# Altium schematic sheet Sheet4.SchDoc
size A3; Organization: Altium Limited; Address1: L3, 12a Rodborough Rd; Address2: Frenchs Forest; Address3: NSW; Address4: Australia 2086
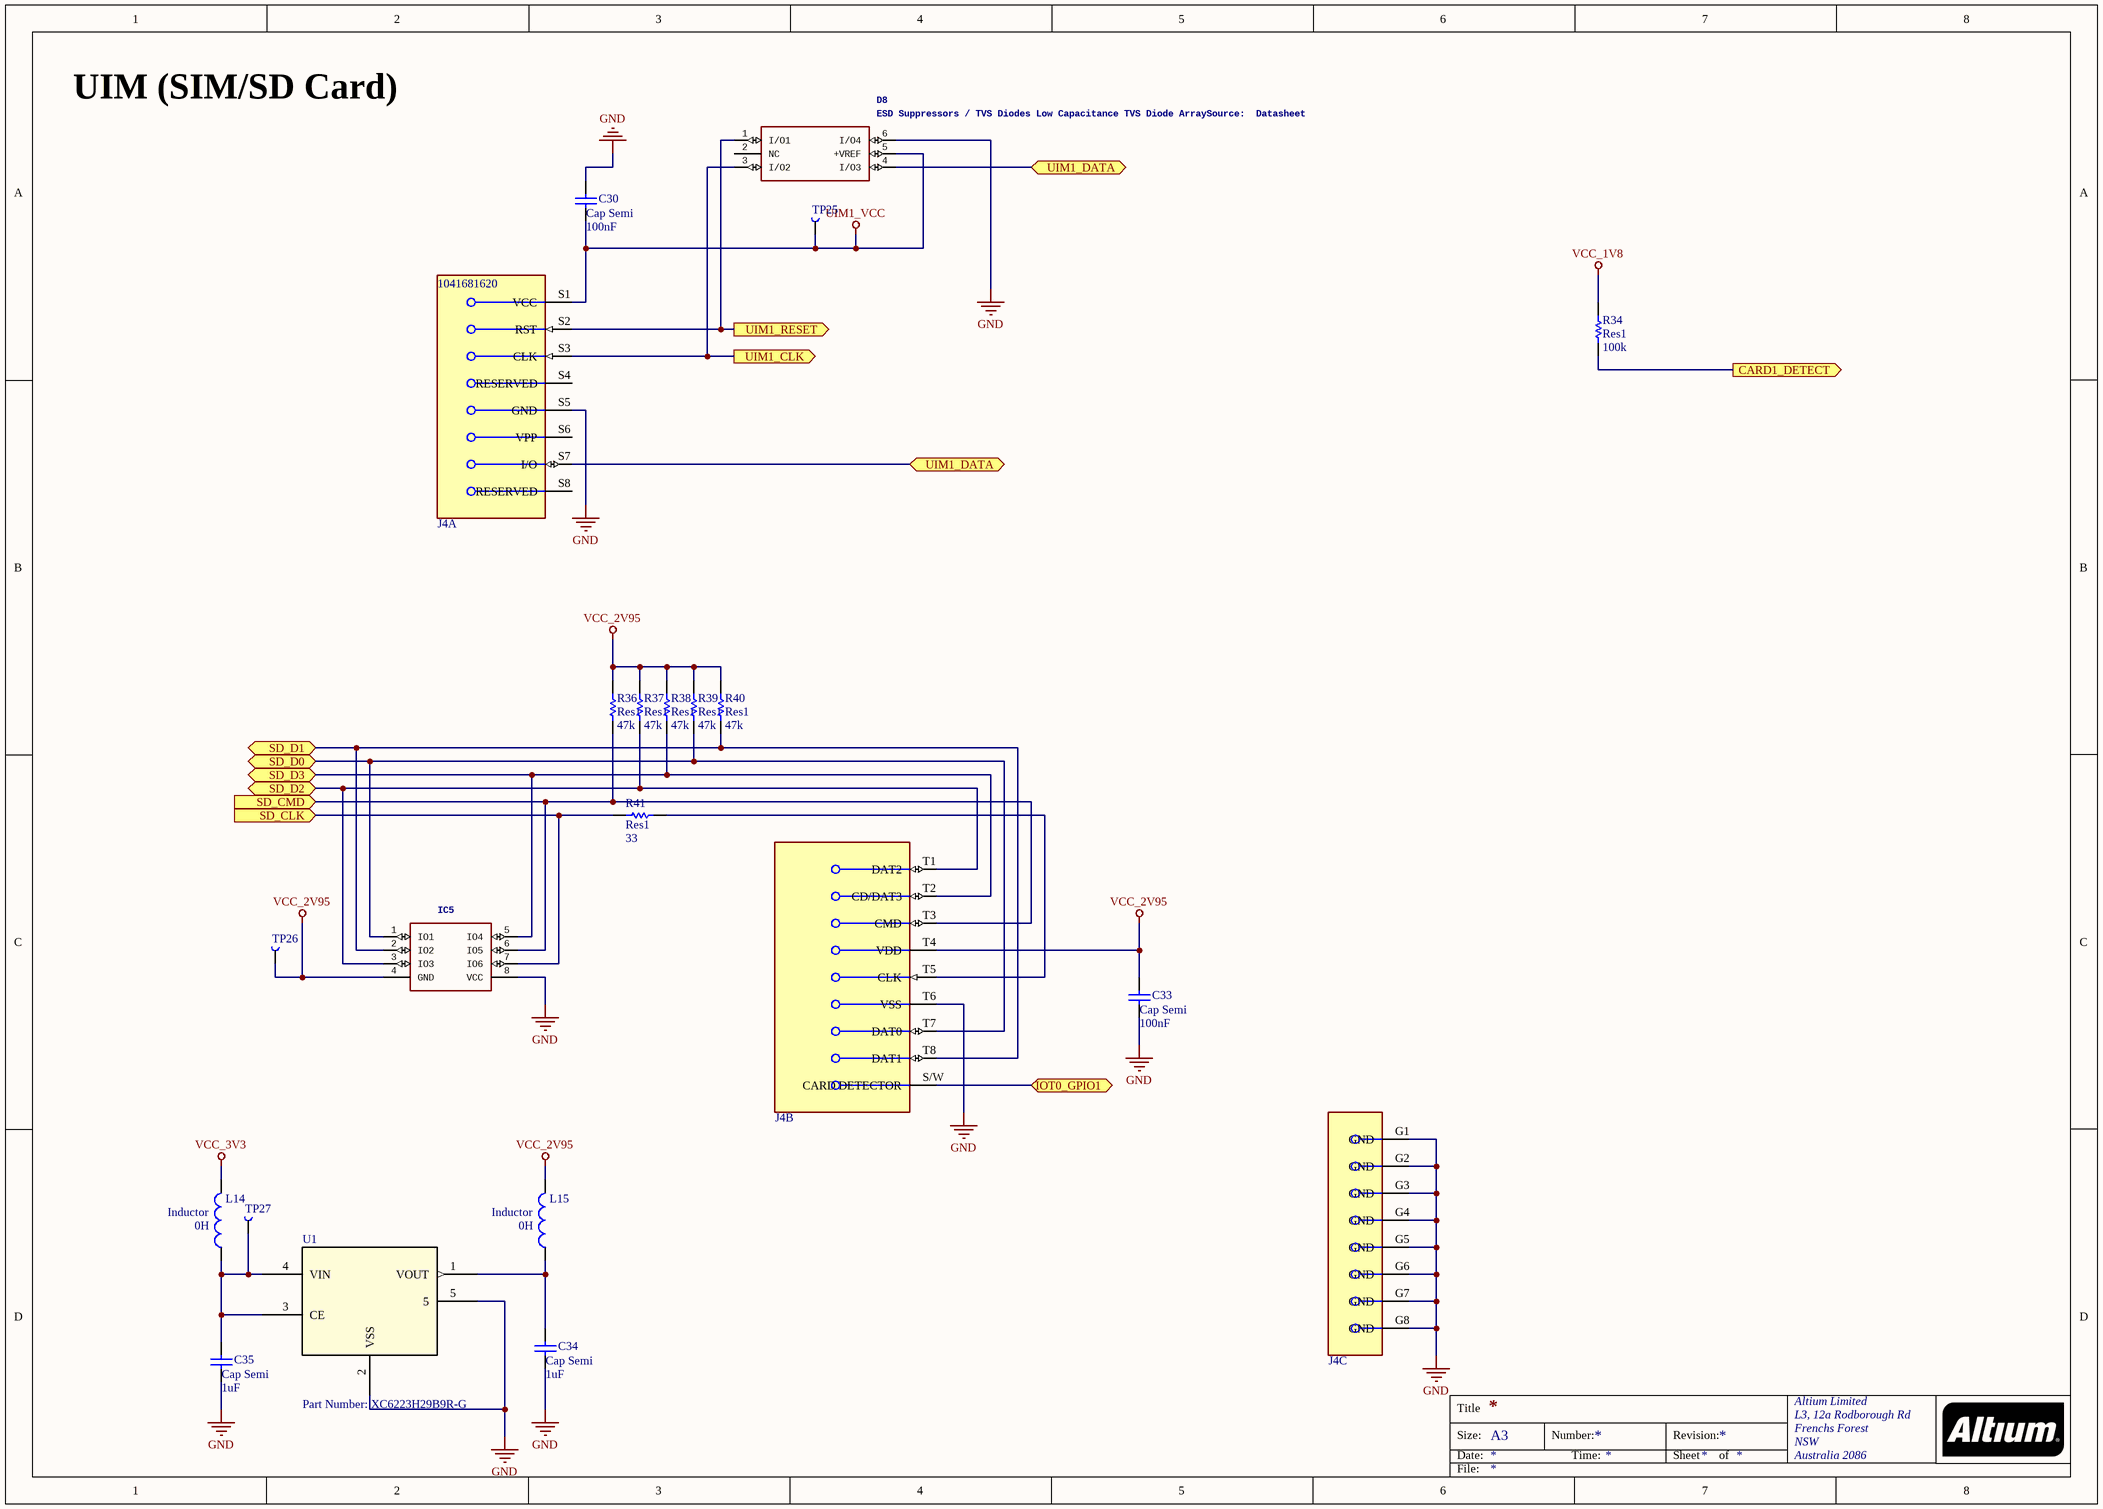
[diagram p0: Sheet4.SchDoc]

## Parts
C30  Cap Semi  value 100nF  [CAP 0402/1005]
C33  Cap Semi  value 100nF  [CAP 0402/1005]
C34  Cap Semi  value 1uF  [CAP 0402/1005]
C35  Cap Semi  value 1uF  [CAP 0402/1005]
D8  ESD Suppressors / TVS Diodes Low Capacitance TVS Diode ArraySource:  Datasheet  [SON50P100X145X65-6N]
IC5  (no value)  [RSE0008A]
J4  104168-1620  [Molex_104168-1620_MFG]  (value not drawn)  (parts A,B,C of 3)
L14  Inductor  value 0H  [INDC1608L]
L15  Inductor  value 0H  [INDC1608L]
R34  Res1  value 100k  [RES 0402/1005]
R36  Res1  value 47k  [RES 0402/1005]
R37  Res1  value 47k  [RES 0402/1005]
R38  Res1  value 47k  [RES 0402/1005]
R39  Res1  value 47k  [RES 0402/1005]
R40  Res1  value 47k  [RES 0402/1005]
R41  Res1  value 33  [RES 0402/1005]
TP25  TestPoint  [TestPoint]  (value not drawn)
TP26  TestPoint  [TestPoint]  (value not drawn)
TP27  TestPoint  [TestPoint]  (value not drawn)
U1  Part Number: XC6223H29B9R-G  [USPQ-4B03]

## Ports
CARD1_DETECT (out), IOT0_GPIO1 (bidir), SD_CLK (in), SD_CMD (in), SD_D0 (bidir), SD_D1 (bidir), SD_D2 (bidir), SD_D3 (bidir), UIM1_CLK (out), UIM1_DATA (bidir), UIM1_RESET (out)

## Nets
GND: C30.2 C33.1 C34.1 C35.1 D8.6(I/O4) IC5.8(VCC) J4.G1(GND) J4.G2(GND) J4.G3(GND) J4.G4(GND) J4.G5(GND) J4.G6(GND) J4.G7(GND) J4.G8(GND) J4.S5(GND) J4.T6(VSS) U1.2(VSS) U1.5
UIM1_VCC: C30.1 D8.5(+VREF) J4.S1(VCC) TP25.1(TP)
VCC_1V8: R34.1
VCC_2V95: C33.2 IC5.4(GND) J4.T4(VDD) L15.2 R36.2 R37.2 R38.2 R39.2 R40.2 TP26.1(TP)
VCC_3V3: L14.2
CARD1_DETECT: R34.2 ; port CARD1_DETECT
IOT0_GPIO1: J4.S/W(CARD_DETECTOR) ; port IOT0_GPIO1
SD_CLK: IC5.7(IO6) R41.2 ; port SD_CLK
SD_CMD: IC5.6(IO5) J4.T3(CMD) R36.1 ; port SD_CMD
SD_D0: IC5.1(IO1) J4.T7(DAT0) R39.1 ; port SD_D0
SD_D1: IC5.2(IO2) J4.T8(DAT1) R40.1 ; port SD_D1
SD_D2: IC5.3(IO3) J4.T1(DAT2) R37.1 ; port SD_D2
SD_D3: IC5.5(IO4) J4.T2(CD/DAT3) R38.1 ; port SD_D3
UIM1_CLK: D8.3(I/O2) J4.S3(CLK) ; port UIM1_CLK
UIM1_DATA: D8.4(I/O3) J4.S7(I/O) ; port UIM1_DATA
UIM1_RESET: D8.1(I/O1) J4.S2(RST) ; port UIM1_RESET
NetC34_2: C34.2 L15.1 U1.1(VOUT)
NetC35_2: C35.2 L14.1 TP27.1(TP) U1.3(CE) U1.4(VIN)
NetJ4_T5: J4.T5(CLK) R41.1

Not connected (* = marked no-connect by the designer): D8 2(NC); J4 S4(RESERVED) S6(VPP) S8(RESERVED)

## Notes on the sheet
- UIM (SIM/SD Card)
- Title
- Size:
- Date:
- A3
- Number:
- Time:
- Revision:
- Sheet
- of
- File:

## Library data of the parts
C30 C33 = Cap Semi: 0.1µF -20%, +80% 16V Ceramic Capacitor Y5V (F) 0402 (1005 Metric); Part Number: VJ0402V104ZXJCW1BC; Published: 8-Jun-2000; LatestRevisionDate: 29-May-2009; LatestRevisionNote: IPC-7351 Footprint Added.; PackageReference: C1206; PackageDescription: Chip Capacitor
  C30: Supplier Link: *
  C33: Supplier Link: https://www.digikey.com/product-detail/en/vishay-vitramon/VJ0402V104ZXJCW1BC/720-1523-1-ND/420979
C34 C35 = Cap Semi: 1µF ±10% 10V Ceramic Capacitor X5R 0402 (1005 Metric); Part Number: GRM155R61A105KE15D; Available: 0; Published: 8-Jun-2000; LatestRevisionDate: 29-May-2009; LatestRevisionNote: IPC-7351 Footprint Added.; PackageReference: C1206; PackageDescription: Chip Capacitor; Supplier Link: https://www.digikey.com/product-detail/en/murata-electronics-north-america/GRM155R61A105KE15D/490-3890-1-ND/965932; Supplier Link 2: https://www.digikey.com/product-detail/en/taiyo-yuden/LMK105BJ105KVHF/587-3712-6-ND/4811286; Part Number 2: LMK105BJ105KVHF
D8 = RCLAMP0503N.TCT: 30V Clamp 3A (8/20µs) Ipp Tvs Diode Surface Mount SLP1510N6; Manufacturer_Name: SEMTECH; GateName_1: G$1; SymbolName_1: RCLAMP0503N.TCT; LibraryName: RCLAMP0503N.TCT; DeviceSetName: RCLAMP0503N.TCT; Package: SON50P100X145X65-6N; Manufacturer_Part_Number: RCLAMP0503N.TCT; Mouser_Part_Number: 947-RCLAMP0503N.TCT; Mouser_Price-Stock: https://www.mouser.com/Search/Refine.aspx?Keyword=947-RCLAMP0503N.TCT; RS_Part_Number: 947-RCLAMP0503N.TCT; RS_Price-Stock: https://www.mouser.com/Search/Refine.aspx?Keyword=947-RCLAMP0503N.TCT; Height: 0.65mm; Part Number: RCLAMP0503N.TCT; Supplier Link: https://www.digikey.com/product-detail/en/semtech-corporation/RCLAMP0503N.TCT/RCLAMP0503N.TCTCT-ND/5113715
IC5 = TPD6E004RSER: Clamp  Ipp Tvs Diode Surface Mount 8-UQFN (1.5x1.5); Manufacturer_Name: Texas Instruments; GateName_1: G$1; SymbolName_1: TPD6E004RSER; LibraryName: TPD6E004RSER; DeviceSetName: TPD6E004RSER; Package: RSE0008A; Part Number: TPD6E004RSER; Mouser_Part_Number: 595-TPD6E004RSER; Mouser_Price-Stock: https://www.mouser.com/Search/Refine.aspx?Keyword=595-TPD6E004RSER; RS_Part_Number: 1626446; RS_Price-Stock: http://uk.rs-online.com/web/p/products/1626446; Height: mm; Supplier Link: https://www.digikey.com/product-detail/en/texas-instruments/TPD6E004RSER/296-23619-1-ND/1913507
J4 = 104168-1620: 8 Position Card Connector Combo - microSD™, Micro SIM Surface Mount, Right Angle Gold; Part Number: 1041681620; Supplier Link: https://www.digikey.com/product-detail/en/molex/1041681620/WM12820CT-ND/5823214
L14 L15 = Inductor: 220 Ohms @ 100MHz 1 Power Line Ferrite Bead 0603 (1608 Metric) 2.2A 50 mOhm; Part Number: MPZ1608S221ATA00; Code_IEC: 1005; Published: 8-Jun-2000; LatestRevisionDate: 29-May-2009; LatestRevisionNote: IPC-7351 Footprint Added.; PackageReference: 0402-A; Publisher: Altium Limited; PackageDescription: Chip Inductor; Code_JEITA: 0402; Supplier Link: https://www.digikey.com/product-detail/en/tdk-corporation/MPZ1608S221ATA00/445-1565-1-ND/571895
R34 = Res1: 100 kOhms ±1% 0.1W, 1/10W Chip Resistor 0402 (1005 Metric) Automotive AEC-Q200 Thick Film; Part Number: RK73H1ETTP1003F; Published: 8-Jun-2000; LatestRevisionDate: 17-Jul-2002; LatestRevisionNote: Re-released for DXP Platform.; PackageReference: AXIAL-0.3; PackageDescription: Axial Device, Thru-Hole; 2 Leads; 0.3 in Pin Spacing; Supplier Link: https://www.digikey.com/product-detail/en/koa-speer-electronics-inc/RK73H1ETTP1003F/2019-RK73H1ETTP1003FCT-ND/9846200
R36-R40 = Res1: 47 kOhms ±5% 0.063W, 1/16W Chip Resistor 0402 (1005 Metric) Moisture Resistant Thick Film; Part Number: RC0402JR-0747KL; Published: 8-Jun-2000; LatestRevisionDate: 17-Jul-2002; LatestRevisionNote: Re-released for DXP Platform.; PackageReference: AXIAL-0.3; PackageDescription: Axial Device, Thru-Hole; 2 Leads; 0.3 in Pin Spacing; Supplier Link: https://www.digikey.com/product-detail/en/yageo/RC0402JR-0747KL/311-47KJRCT-ND/729432
R41 = Res1: 33 Ohms ±5% 0.1W, 1/10W Chip Resistor 0402 (1005 Metric) Automotive AEC-Q200 Thick Film; Part Number: RK73B1ETTP330J; Published: 8-Jun-2000; LatestRevisionDate: 17-Jul-2002; LatestRevisionNote: Re-released for DXP Platform.; PackageReference: AXIAL-0.3; PackageDescription: Axial Device, Thru-Hole; 2 Leads; 0.3 in Pin Spacing; Supplier Link: https://www.digikey.com/product-detail/en/koa-speer-electronics-inc/RK73B1ETTP330J/2019-RK73B1ETTP330JCT-ND/9846009
U1 = XC6223H29B9R-G: LDO Voltage Regulators; Vendor: Torex Semiconductor; Built_By: EMA_UL_Team; Copyright: Copyright (C) 2018 Accelerated Designs. All rights reserved; RefDes: RefDes; Type: DEV; Value: Value; Supplier Link: https://eu.mouser.com/ProductDetail/Torex-Semiconductor/XC6223H29B9R-G?qs=%2Fha2pyFadujZ3DCSmHHHg6sdaRWvEXKOM0E8R6SW2XDQmdh01F6iPg%3D%3D